# EAGLE design UpTo11.MotherBoard (EAGLE 7.6.0)
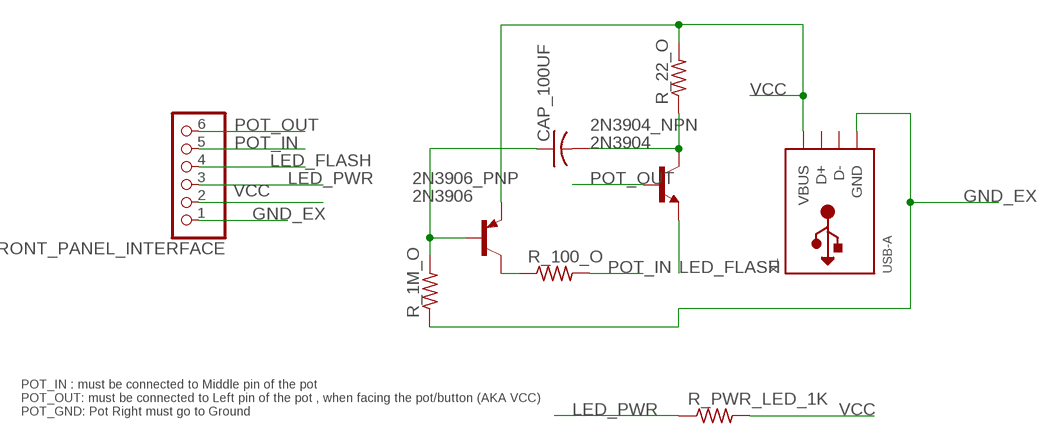
[diagram p0: schematic, sheet 1]

## Parts
2N3904_NPN  2N3904  [TO92]
2N3906_PNP  2N3906  [TO92]
CAP_100UF  C-US025-030X050  [C025-030X050]
FRONT_PANEL_INTERFACE  PINHD-1X6  [1X06]
R_1M_O  R-US_0207/10  [0207/10]
R_22_O  R-US_0207/10  [0207/10]
R_100_O  R-US_0207/10  [0207/10]
R_PWR_LED_1K  R-US_0207/10  [0207/10]
X1  USB-A  [MOLEX_480371000]

## Nets
GND_EX: FRONT_PANEL_INTERFACE.1 R_1M_O.1 X1.4(GND)
LED_FLASH: 2N3904_NPN.3(E) FRONT_PANEL_INTERFACE.4
LED_PWR: FRONT_PANEL_INTERFACE.3 R_PWR_LED_1K.1
N$2: 2N3904_NPN.1(C) CAP_100UF.2 R_22_O.1
N$5: 2N3906_PNP.2(B) CAP_100UF.1 R_1M_O.2
N$6: 2N3906_PNP.1(C) R_100_O.1
POT_IN: FRONT_PANEL_INTERFACE.5 R_100_O.2
POT_OUT: 2N3904_NPN.2(B) FRONT_PANEL_INTERFACE.6
VCC: 2N3906_PNP.3(E) FRONT_PANEL_INTERFACE.2 R_22_O.2 R_PWR_LED_1K.2 X1.1(VBUS)
Unconnected: X1.2(D-) X1.3(D+)

## Notes on the sheet
- POT_IN : must be connected to Middle pin of the pot
  POT_OUT: must be connected to Left pin of the pot , when facing the pot/button (AKA VCC)
  POT_GND: Pot Right must go to Ground

## Library data of the parts
2N3904_NPN = transistor:2N3904: NPN TRANSISTOR
2N3906_PNP = transistor-pnp:2N3906: PNP Transistor
CAP_100UF = adafruit:C-US: CAPACITOR, American symbol
FRONT_PANEL_INTERFACE = adafruit:PINHD-1X6: PIN HEADER
R_1M_O R_22_O R_100_O R_PWR_LED_1K = adafruit:R-US_: RESISTOR, American symbol
X1 = adafruit:USB-A: USB type A 'plug' Used for things that can directly connect to a USB port, say USB key

## Board
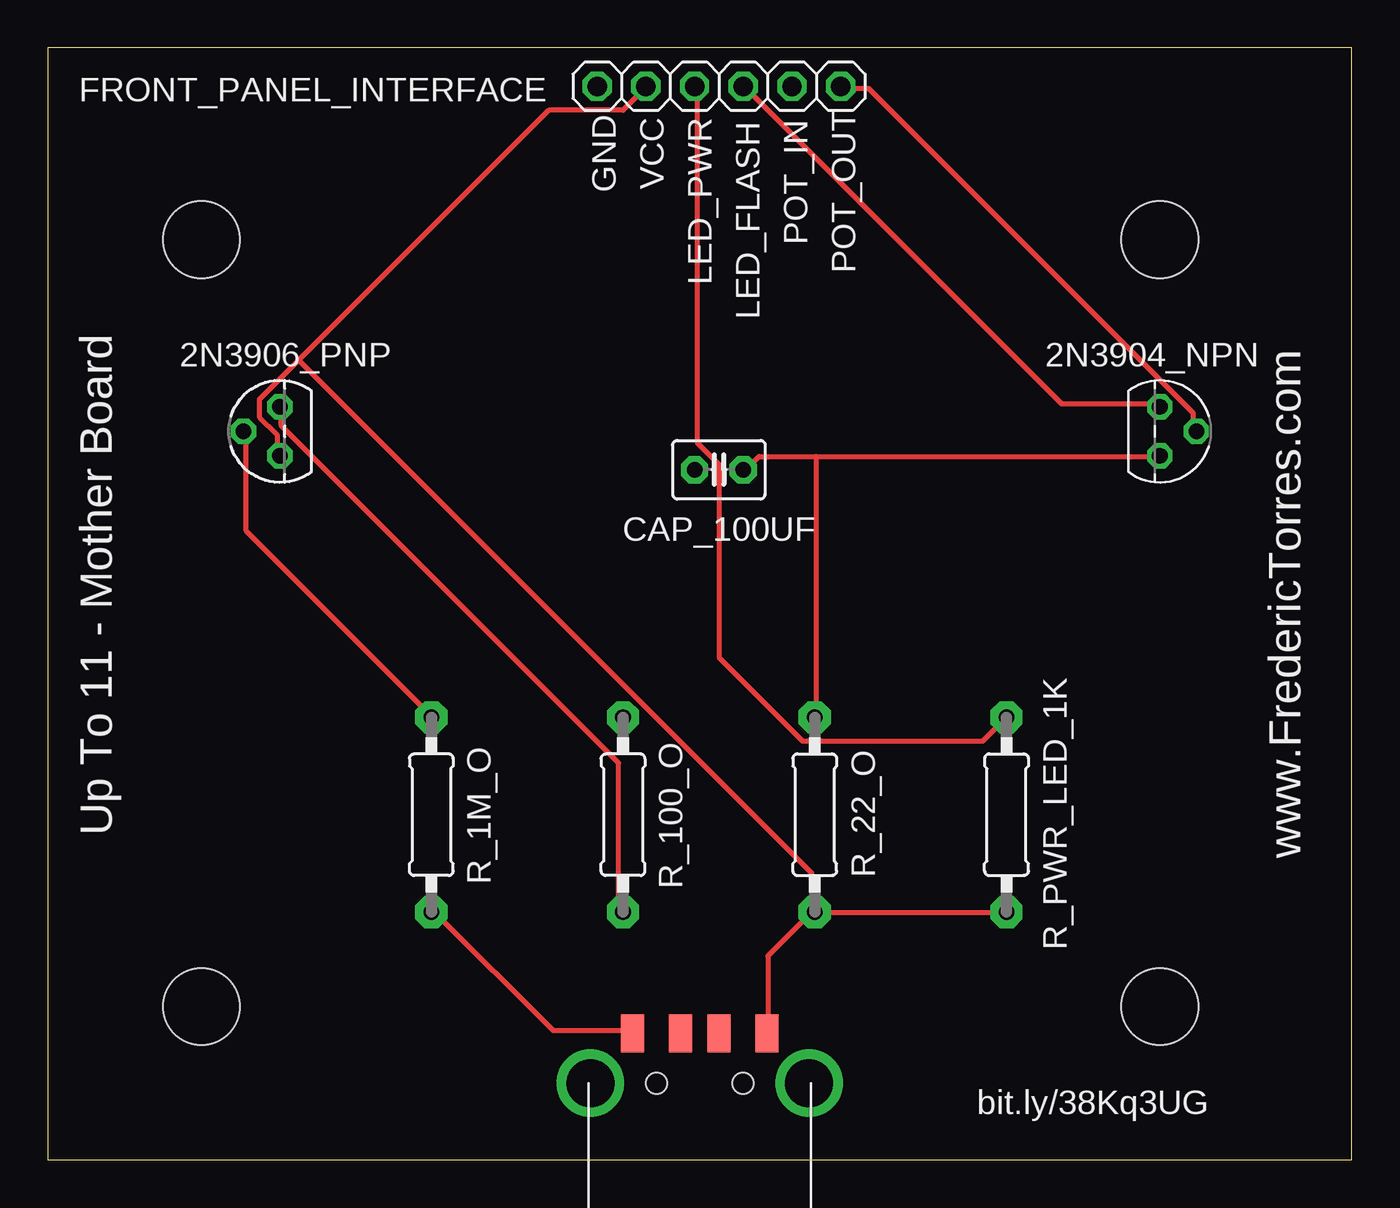
[diagram p1: board, top side]
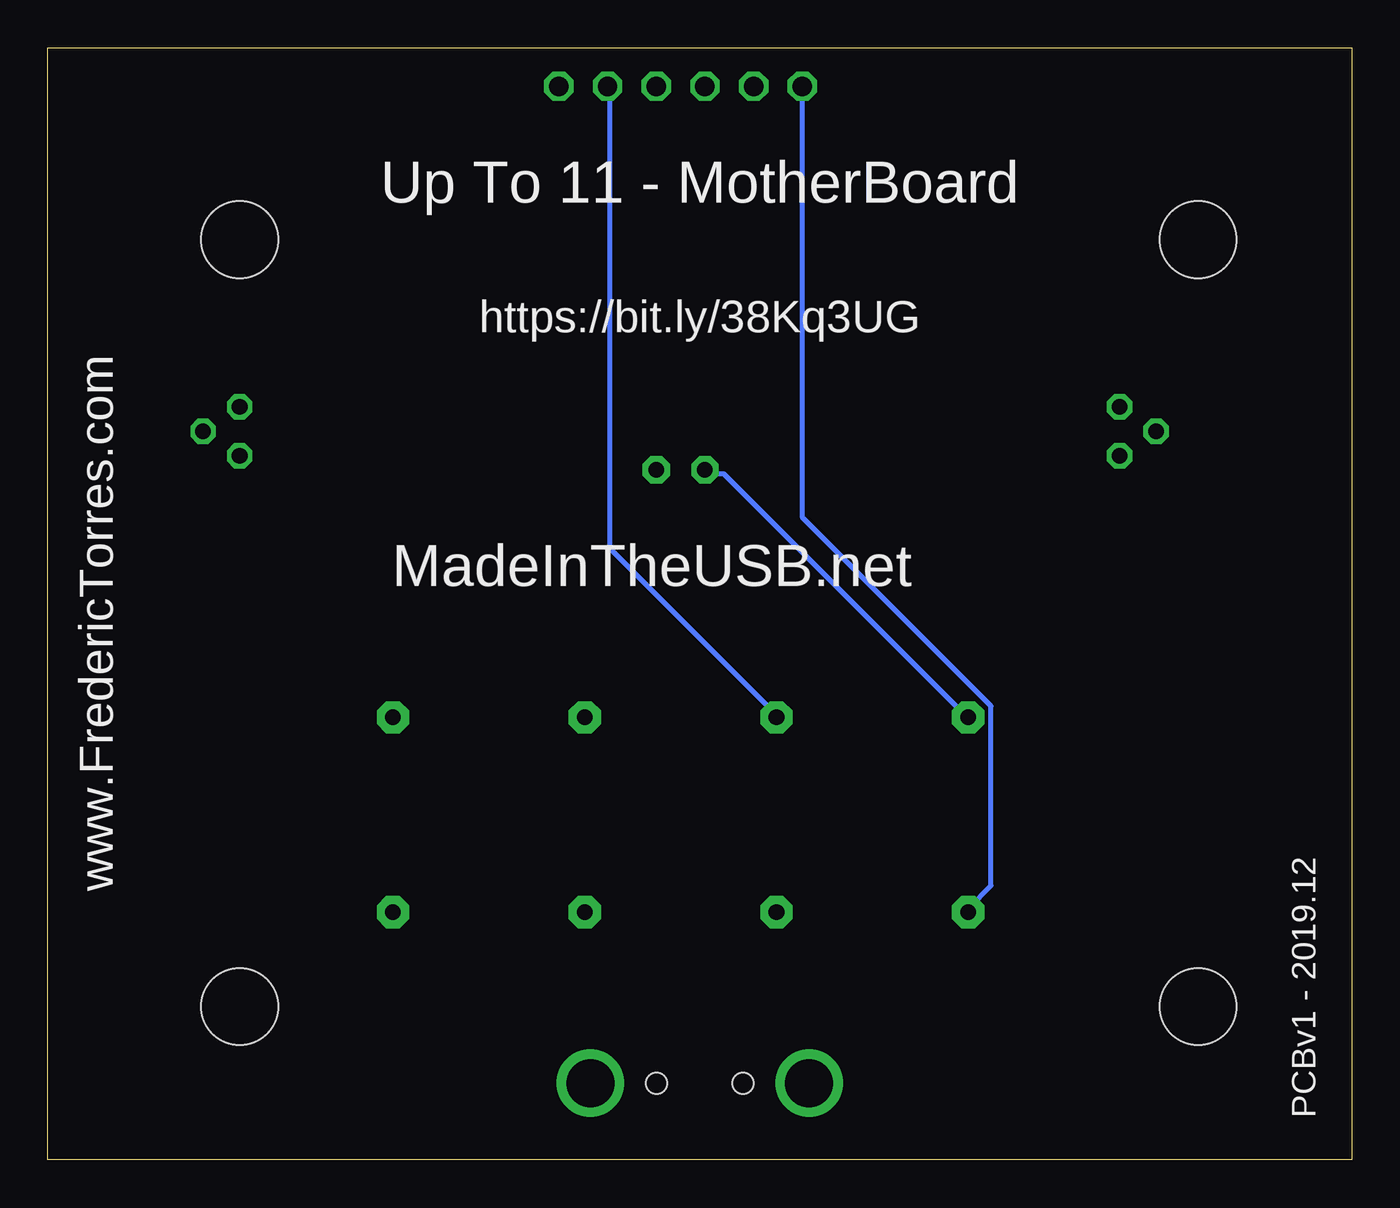
[diagram p2: board, bottom side, seen from below]

Size 68 x 58 mm. Coordinates in mm from the lower left corner, seen from the top.
Outline: 0,0 68,0 68,58 0,58 0,0
Copper layers (1*16): Top 0.035mm / dielectric 1.5mm / Bottom 0.035mm
Design rules "default": minimum track width 10mil, minimum drill 24mil, track to track 8mil, track to pad 8mil, pad to pad 8mil, via to via 8mil, smd to smd 8mil, copper to edge 40mil, drill to drill 8mil, minimum pad ring 10mil, minimum via ring 8mil, stop-mask expansion 4mil, vias tented up to drill 0mil, thermal gap 10mil
Holes 4 mm at 8,48 8,8 58,48 58,8

### Footprints (pad centres in the part's own frame; a part is rotated, then mirrored left to right if it is on the bottom)
TO92 = drill 0.813 octagon: 1 1.27,0; 2 0,1.905; 3 -1.27,0
C025-030X050 = drill 0.813 pad 1.422 octagon: 1 -1.27,0; 2 1.27,0
1X06 = drill 1.016 octagon: 1 -6.35,0; 2 -3.81,0; 3 -1.27,0; 4 1.27,0; 5 3.81,0; 6 6.35,0
0207/10 = drill 0.813 pad 1.676 octagon: 1 -5.08,0; 2 5.08,0
MOLEX_480371000 = smd 1.2 x 2: 1 3.5,2.6; 2 1,2.6; 3 -1,2.6; 4 -3.5,2.6 | drill 2.5: M1 -5.7,0; M2 5.7,0 | hole 1.1: -2.25,0; 2.25,0

### Placement (x,y rotation side)
2N3904_NPN  58,38 270 top
2N3906_PNP  12.1,38 90 top
CAP_100UF  35,36 0 top
FRONT_PANEL_INTERFACE  35,56 0 top
R_1M_O  20,18 90 top
R_22_O  40,18 270 top
R_100_O  30,18 90 top
R_PWR_LED_1K  50,18 270 top
X1  34,4 0 top

### Tracks (layer width: path | path; a pad name or v marks a point on that pad's centre or on a via)
GND_EX
  Top 0.254: X1.4 30.46,6.75 26.35,6.75 20.17,12.92 R_1M_O.1
  Bottom 0.254: FRONT_PANEL_INTERFACE.1 28.63,55.89 28.63,33.49 18.8,23.66 18.8,14.29 19.95,13.15 R_1M_O.1
LED_FLASH
  Top 0.254: 2N3904_NPN.3 57.89,39.44 52.86,39.44 36.41,55.89 FRONT_PANEL_INTERFACE.4
LED_PWR
  Top 0.254: FRONT_PANEL_INTERFACE.3 33.89,55.89 33.89,37.38 35.03,36.23 35.03,26.18 39.38,21.83 48.75,21.83 49.89,22.98 R_PWR_LED_1K.1
N$2
  Top 0.254: 40.06,36.69 37.09,36.69 36.41,36.01 CAP_100UF.2 | 40.06,36.69 57.89,36.69 2N3904_NPN.1 | 40.06,36.69 40.06,23.2 R_22_O.1
N$5
  Top 0.254: 2N3906_PNP.2 10.34,37.84 10.34,32.81 19.95,23.2 R_1M_O.2
  Bottom 0.254: CAP_100UF.1 33.66,35.78 32.75,35.78 20.17,23.2 R_1M_O.2
N$6
  Top 0.254: 2N3906_PNP.1 12.17,39.21 12.17,38.29 29.77,20.69 29.77,13.15 R_100_O.1
POT_IN
  Bottom 0.254: FRONT_PANEL_INTERFACE.5 38.69,55.89 38.69,31.89 30,23.2 R_100_O.2
POT_OUT
  Top 0.254: 2N3904_NPN.2 59.72,38.06 59.72,38.98 42.81,55.89 41.43,55.89 FRONT_PANEL_INTERFACE.6
VCC
  Top 0.254: X1.1 37.55,6.75 37.55,10.63 39.83,12.92 R_22_O.2 | R_PWR_LED_1K.2 49.89,12.92 40.06,12.92 R_22_O.2 | 13.09,41.72 26.12,54.75 30,54.75 31.15,55.89 FRONT_PANEL_INTERFACE.2 | 13.09,41.72 11.03,39.66 11.03,38.75 11.95,37.84 11.95,36.92 2N3906_PNP.3 | 13.09,41.72 39.83,14.98 39.83,13.15 R_22_O.2

### Text on the board
tNames: GND | VCC | POT_IN | LED_PWR | POT_OUT | LED_FLASH | Up To 11 - Mother Board | www.FredericTorres.com | bit.ly/38Kq3UG
bNames: Up To 11 - MotherBoard | https://bit.ly/38Kq3UG | MadeInTheUSB.net | www.FredericTorres.com | PCBv1 - 2019.12